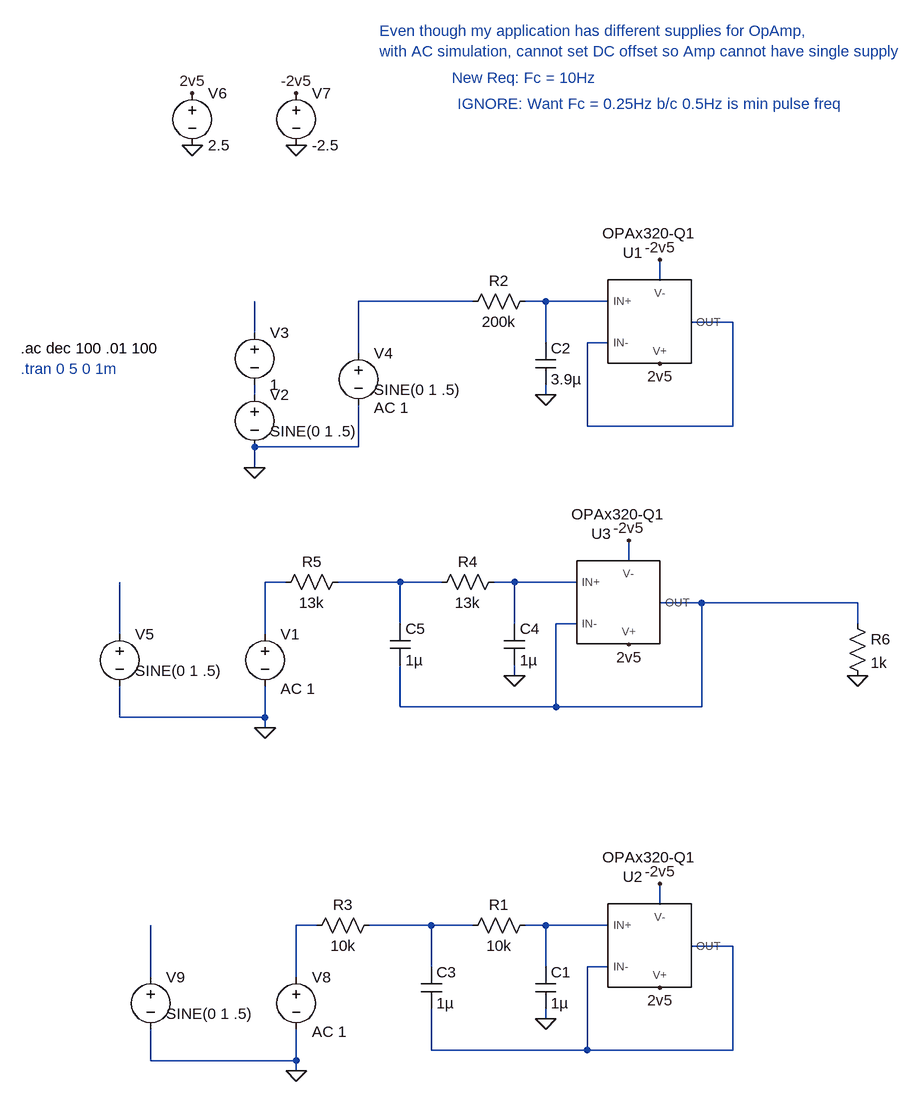
[diagram p0: schematic Sallen-Key LPF.asc]
Sallen-Key LPF.asc, the LTspice schematic file:
Version 4.1
SHEET 1 880 1364
WIRE 272 128 272 96
WIRE -16 160 -192 160
WIRE 96 160 64 160
WIRE 192 160 96 160
WIRE 384 192 320 192
WIRE -352 208 -352 160
WIRE 96 224 96 160
WIRE 192 224 160 224
WIRE -192 240 -192 160
WIRE -352 304 -352 288
WIRE 96 304 96 288
WIRE 160 352 160 224
WIRE 384 352 384 192
WIRE 384 352 160 352
WIRE -192 384 -192 320
WIRE -192 384 -352 384
WIRE -352 416 -352 384
WIRE 224 560 224 528
WIRE -304 592 -336 592
WIRE -128 592 -224 592
WIRE -64 592 -128 592
WIRE 48 592 16 592
WIRE 144 592 48 592
WIRE 336 624 272 624
WIRE 576 624 336 624
WIRE -128 656 -128 592
WIRE 48 656 48 592
WIRE 144 656 112 656
WIRE 576 656 576 624
WIRE -560 672 -560 592
WIRE -336 672 -336 592
WIRE 48 736 48 720
WIRE -128 784 -128 720
WIRE 112 784 112 656
WIRE 112 784 -128 784
WIRE 336 784 336 624
WIRE 336 784 112 784
WIRE -560 800 -560 752
WIRE -336 800 -336 752
WIRE -336 800 -560 800
WIRE -336 816 -336 800
WIRE 272 1088 272 1056
WIRE -256 1120 -288 1120
WIRE -80 1120 -176 1120
WIRE -16 1120 -80 1120
WIRE 96 1120 64 1120
WIRE 192 1120 96 1120
WIRE 384 1152 320 1152
WIRE -80 1184 -80 1120
WIRE 96 1184 96 1120
WIRE 192 1184 160 1184
WIRE -512 1200 -512 1120
WIRE -288 1200 -288 1120
WIRE 96 1264 96 1248
WIRE -80 1312 -80 1248
WIRE 160 1312 160 1184
WIRE 160 1312 -80 1312
WIRE 384 1312 384 1152
WIRE 384 1312 160 1312
WIRE -512 1328 -512 1280
WIRE -288 1328 -288 1280
WIRE -288 1328 -512 1328
WIRE -288 1344 -288 1328
FLAG 96 304 0
FLAG 272 256 2v5
FLAG -352 416 0
FLAG -448 -80 0
FLAG -448 -160 2v5
FLAG -288 -80 0
FLAG -288 -160 -2v5
FLAG 272 96 -2v5
FLAG 48 736 0
FLAG 224 688 2v5
FLAG -336 816 0
FLAG 224 528 -2v5
FLAG 96 1264 0
FLAG 272 1216 2v5
FLAG -288 1344 0
FLAG 272 1056 -2v5
FLAG 576 736 0
SYMBOL OPAx320-Q1 256 192 M180
WINDOW 0 -26 122 Bottom 2
WINDOW 3 -1 121 Top 2
SYMATTR InstName U1
SYMBOL res 80 144 R90
WINDOW 0 0 56 VBottom 2
WINDOW 3 32 56 VTop 2
SYMATTR InstName R2
SYMATTR Value 200k
SYMBOL cap 80 224 R0
SYMATTR InstName C2
SYMATTR Value 3.9µ
SYMBOL voltage -352 288 R0
WINDOW 3 24 72 Left 2
WINDOW 123 24 44 Left 2
WINDOW 39 0 0 Left 0
SYMATTR Value SINE(0 1 .5)
SYMATTR InstName V2
SYMBOL voltage -352 192 R0
WINDOW 123 0 0 Left 0
WINDOW 39 0 0 Left 0
SYMATTR InstName V3
SYMATTR Value 1
SYMBOL voltage -192 224 R0
WINDOW 3 24 72 Left 2
WINDOW 123 24 100 Left 2
WINDOW 39 0 0 Left 0
SYMATTR Value SINE(0 1 .5)
SYMATTR Value2 AC 1
SYMATTR InstName V4
SYMBOL voltage -448 -176 R0
WINDOW 123 0 0 Left 0
WINDOW 39 0 0 Left 0
SYMATTR InstName V6
SYMATTR Value 2.5
SYMBOL voltage -288 -176 R0
WINDOW 123 0 0 Left 0
WINDOW 39 0 0 Left 0
SYMATTR InstName V7
SYMATTR Value -2.5
SYMBOL OPAx320-Q1 208 624 M180
WINDOW 0 -26 122 Bottom 2
WINDOW 3 -1 121 Top 2
SYMATTR InstName U3
SYMBOL res 32 576 R90
WINDOW 0 0 56 VBottom 2
WINDOW 3 32 56 VTop 2
SYMATTR InstName R4
SYMATTR Value 13k
SYMBOL cap 32 656 R0
SYMATTR InstName C4
SYMATTR Value 1µ
SYMBOL res -208 576 R90
WINDOW 0 0 56 VBottom 2
WINDOW 3 32 56 VTop 2
SYMATTR InstName R5
SYMATTR Value 13k
SYMBOL cap -144 656 R0
SYMATTR InstName C5
SYMATTR Value 1µ
SYMBOL voltage -336 656 R0
WINDOW 3 24 72 Left 2
WINDOW 123 24 100 Left 2
WINDOW 39 0 0 Left 0
SYMATTR Value ""
SYMATTR Value2 AC 1
SYMATTR InstName V1
SYMBOL voltage -560 656 R0
WINDOW 3 24 72 Left 2
WINDOW 123 24 44 Left 2
WINDOW 39 0 0 Left 0
SYMATTR Value SINE(0 1 .5)
SYMATTR InstName V5
SYMBOL OPAx320-Q1 256 1152 M180
WINDOW 0 -26 122 Bottom 2
WINDOW 3 -1 121 Top 2
SYMATTR InstName U2
SYMBOL res 80 1104 R90
WINDOW 0 0 56 VBottom 2
WINDOW 3 32 56 VTop 2
SYMATTR InstName R1
SYMATTR Value 10k
SYMBOL cap 80 1184 R0
SYMATTR InstName C1
SYMATTR Value 1µ
SYMBOL res -160 1104 R90
WINDOW 0 0 56 VBottom 2
WINDOW 3 32 56 VTop 2
SYMATTR InstName R3
SYMATTR Value 10k
SYMBOL cap -96 1184 R0
SYMATTR InstName C3
SYMATTR Value 1µ
SYMBOL voltage -288 1184 R0
WINDOW 3 24 72 Left 2
WINDOW 123 24 100 Left 2
WINDOW 39 0 0 Left 0
SYMATTR Value ""
SYMATTR Value2 AC 1
SYMATTR InstName V8
SYMBOL voltage -512 1184 R0
WINDOW 3 24 72 Left 2
WINDOW 123 24 44 Left 2
WINDOW 39 0 0 Left 0
SYMATTR Value SINE(0 1 .5)
SYMATTR InstName V9
SYMBOL res 560 640 R0
SYMATTR InstName R6
SYMATTR Value 1k
TEXT -40 -144 Left 2 ;IGNORE: Want Fc = 0.25Hz b/c 0.5Hz is min pulse freq
TEXT -712 232 Left 2 !.ac dec 100 .01 100
TEXT -712 264 Left 2 ;.tran 0 5 0 1m
TEXT -160 -256 Left 2 ;Even though my application has different supplies for OpAmp, \nwith AC simulation, cannot set DC offset so Amp cannot have single supply
TEXT -48 -184 Left 2 ;New Req: Fc = 10Hz

The netlist it stands for:
* Sallen-Key LPF.asc
X§U1 N002 N003 2v5 -2v5 N003 OPAx320-Q1  ; pins IN+ IN- V+ V- OUT
R2 N002 N001 200k
C2 N002 0 3.9µ
V2 N005 0 SINE(0 1 .5)
V3 N004 N005 1
V4 N001 0 SINE(0 1 .5) AC 1
V6 2v5 0 2.5
V7 -2v5 0 -2.5
X§U3 N008 N009 2v5 -2v5 N009 OPAx320-Q1  ; pins IN+ IN- V+ V- OUT
R4 N008 N007 13k
C4 N008 0 1µ
R5 N007 N006 13k
C5 N007 N009 1µ
V1 N006 0 AC 1
V5 N010 0 SINE(0 1 .5)
X§U2 N013 N014 2v5 -2v5 N014 OPAx320-Q1  ; pins IN+ IN- V+ V- OUT
R1 N013 N012 10k
C1 N013 0 1µ
R3 N012 N011 10k
C3 N012 N014 1µ
V8 N011 0 AC 1
V9 N015 0 SINE(0 1 .5)
R6 N009 0 1k
* IGNORE: Want Fc = 0.25Hz b/c 0.5Hz is min pulse freq
.ac dec 100 .01 100
* .tran 0 5 0 1m
* Even though my application has different supplies for OpAmp,
* with AC simulation, cannot set DC offset so Amp cannot have single supply
* New Req: Fc = 10Hz
.lib C:\Users\adnan\OneDrive\Documents\LTspice\MyLib\OPAx320-Q1.LIB
.backanno
.end